# Altium schematic sheet Top.SchDoc
size A4
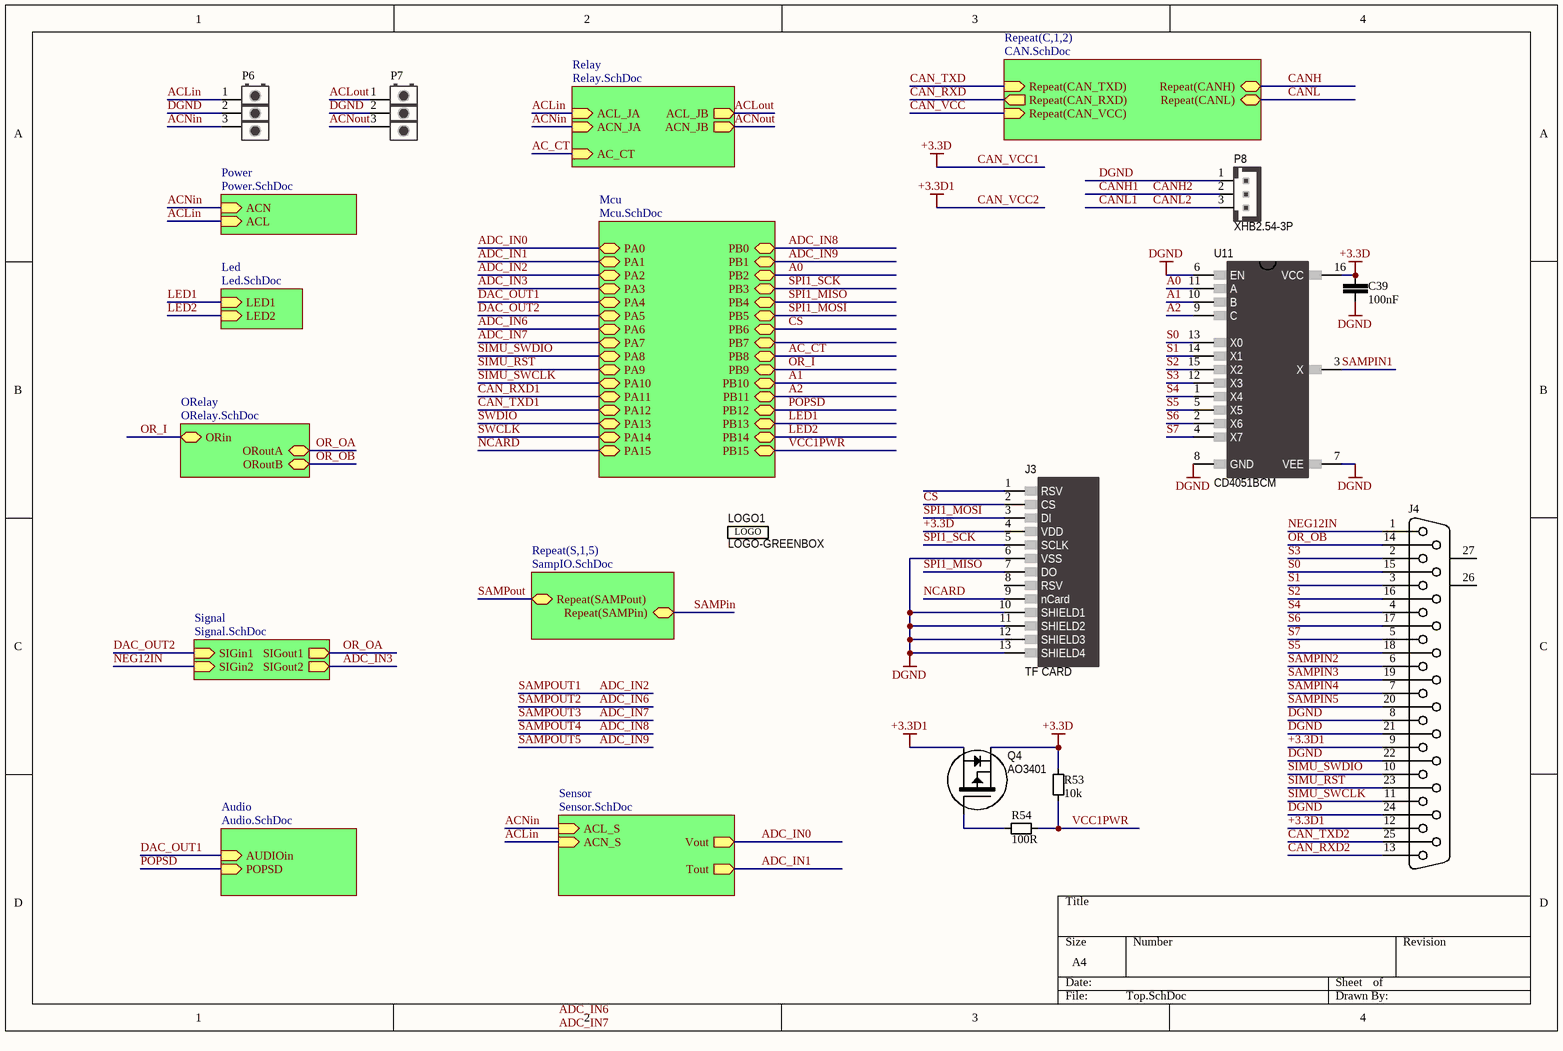
[diagram p0: Top.SchDoc]

## Parts
C39  value 100nF  [0603-C]  (hidden comment: Cap)
J3  TF CARD  [TF-2]
J4  DB25  [DB25F]  (value not drawn)
LOGO1  LOGO-GREENBOX  [LOGO-GREENBOX]
P6  KF7.62-3P  [KF762-3]  (value not drawn)
P7  KF7.62-3P  [KF762-3]  (value not drawn)
P8  XHB2.54-3P  [XH-3]
Q4  AO3401  [SOT-23_N]
R53  value 10k  [0603-R]  (hidden comment: Res)
R54  value 100R  [0603-R]  (hidden comment: Res)
U11  CD4051BCM  [SO-16_N]

## Sub-sheets
Audio = Audio.SchDoc: AUDIOin (in), POPSD (in)
Led = Led.SchDoc: LED1 (in), LED2 (in)
Mcu = Mcu.SchDoc: PA0, PA1, PA2, PA3, PA4, PA5, PA6, PA7, PA8, PA9, PA10, PA11, PA12, PA13, PA14, PA15, PB0, PB1, PB2, PB3, PB4, PB5, PB6, PB7, PB8, PB9, PB10, PB11, PB12, PB13, PB14, PB15
ORelay = ORelay.SchDoc: ORin, ORoutA, ORoutB
Power = Power.SchDoc: ACN (in), ACL (in)
Relay = Relay.SchDoc: ACL_JA (in), ACN_JA (in), ACL_JB (out), ACN_JB (out), AC_CT (in)
Repeat(C,1,2) = CAN.SchDoc: Repeat(CAN_TXD) (in), Repeat(CAN_RXD) (out), Repeat(CANH) (bidir), Repeat(CANL) (bidir), Repeat(CAN_VCC) (in)
Repeat(S,1,5) = SampIO.SchDoc: Repeat(SAMPout), Repeat(SAMPin)
Sensor = Sensor.SchDoc: Vout (out), Tout (out), ACL_S (in), ACN_S (in)
Signal = Signal.SchDoc: SIGin2 (in), SIGout1 (out), SIGin1 (in), SIGout2 (out)

## Nets
+3.3D: C39.1 J3.4(VDD) Q4.2(S) R53.1 U11.16(VCC)  [also labelled CAN_VCC1]
+3.3D1: J4.9 J4.12 Q4.3(D)  [also labelled CAN_VCC2]
DGND: C39.2 J3.6(VSS) J3.10(SHIELD1) J3.11(SHIELD2) J3.12(SHIELD3) J3.13(SHIELD4) J4.8 J4.21 J4.22 J4.24 P6.2 P7.2 P8.1 U11.6(EN) U11.7(VEE) U11.8(GND)
A0: U11.11(A) ; sheet Mcu/PB2
A1: U11.10(B) ; sheet Mcu/PB10
A2: U11.9(C) ; sheet Mcu/PB11
AC_CT: sheet Mcu/PB8, sheet Relay/AC_CT
ACLin: P6.1 ; sheet Power/ACL, sheet Sensor/ACN_S, sheet Relay/ACL_JA
ACLout: P7.1 ; sheet Relay/ACL_JB
ACNin: P6.3 ; sheet Power/ACN, sheet Sensor/ACL_S, sheet Relay/ACN_JA
ACNout: P7.3 ; sheet Relay/ACN_JB
ADC_IN0: sheet Mcu/PA0, sheet Sensor/Vout
ADC_IN1: sheet Mcu/PA1, sheet Sensor/Tout
ADC_IN2: sheet Mcu/PA2  [also labelled SAMPOUT1]
ADC_IN3: sheet Mcu/PA3, sheet Signal/SIGout2
ADC_IN6: sheet Mcu/PA6  [also labelled SAMPOUT2]
ADC_IN7: sheet Mcu/PA7  [also labelled SAMPOUT3]
ADC_IN8: sheet Mcu/PB0  [also labelled SAMPOUT4]
ADC_IN9: sheet Mcu/PB1  [also labelled SAMPOUT5]
CAN_RXD: sheet Repeat(C,1,2)/Repeat(CAN_RXD)
CAN_RXD1: sheet Mcu/PA11
CAN_RXD2: J4.13
CAN_TXD: sheet Repeat(C,1,2)/Repeat(CAN_TXD)
CAN_TXD1: sheet Mcu/PA12
CAN_TXD2: J4.25
CAN_VCC: sheet Repeat(C,1,2)/Repeat(CAN_VCC)
CANH: sheet Repeat(C,1,2)/Repeat(CANH)
CANH1: P8.2  [also labelled CANH2]
CANL: sheet Repeat(C,1,2)/Repeat(CANL)
CANL1: P8.3  [also labelled CANL2]
CS: J3.2(CS) ; sheet Mcu/PB6
DAC_OUT1: sheet Mcu/PA4, sheet Audio/AUDIOin
DAC_OUT2: sheet Mcu/PA5, sheet Signal/SIGin1
LED1: sheet Mcu/PB13, sheet Led/LED1
LED2: sheet Mcu/PB14, sheet Led/LED2
NCARD: J3.9(nCard) ; sheet Mcu/PA15
NEG12IN: J4.1 ; sheet Signal/SIGin2
OR_I: sheet Mcu/PB9, sheet ORelay/ORin
OR_OA: sheet ORelay/ORoutA, sheet Signal/SIGout1
OR_OB: J4.14 ; sheet ORelay/ORoutB
POPSD: sheet Mcu/PB12, sheet Audio/POPSD
S0: J4.15 U11.13(X0)
S1: J4.3 U11.14(X1)
S2: J4.16 U11.15(X2)
S3: J4.2 U11.12(X3)
S4: J4.4 U11.1(X4)
S5: J4.18 U11.5(X5)
S6: J4.17 U11.2(X6)
S7: J4.5 U11.4(X7)
SAMPin: sheet Repeat(S,1,5)/Repeat(SAMPin)
SAMPIN1: U11.3(X)
SAMPIN2: J4.6
SAMPIN3: J4.19
SAMPIN4: J4.7
SAMPIN5: J4.20
SAMPout: sheet Repeat(S,1,5)/Repeat(SAMPout)
SIMU_RST: J4.23 ; sheet Mcu/PA9
SIMU_SWCLK: J4.11 ; sheet Mcu/PA10
SIMU_SWDIO: J4.10 ; sheet Mcu/PA8
SPI1_MISO: J3.7(DO) ; sheet Mcu/PB4
SPI1_MOSI: J3.3(DI) ; sheet Mcu/PB5
SPI1_SCK: J3.5(SCLK) ; sheet Mcu/PB3
SWCLK: sheet Mcu/PA14
SWDIO: sheet Mcu/PA13
VCC1PWR: R53.2 R54.2 ; sheet Mcu/PB15
NetQ4_1: Q4.1(G) R54.1

Not connected (* = marked no-connect by the designer): J3 1(RSV) 8(RSV); J4 26(MH1) 27(MH2)

## Notes on the sheet
- Labels drawn without touching a wire or pin: ADC_IN6, ADC_IN7
- (in symbol LOGO1) LOGO

## Library data of the parts
C39 = C21C100NK1H0: MLCC 100nF 10% 50V X7R 0603; TemperatureRange: -55°C to 150°C; VenderID: MLCC-0603-50V-104K-X7R; Published: 1-Jun-2017; Publisher: GreenBox; MountType: SMT; PackageReference: 0603; Manufacturer: *
J3 = M3DZTF2SPI00: TF CARD Pudsh-Push SPIMode; Manufacturer: TEXAS INSTRUMENTS; VenderID: TF卡座自弹式; Publisher: GreenBox; Published: 1-Jun-2017; PackageReference: TF-2; MountType: SMT; TemperatureRange: *
J4 = PDDD25Z27700: Receptacle Assembly DB25 Vertical; Publisher: GreenBox; Published: 1-Jan-2017; MountType: DIP; PackageReference: DB25F; VenderID: DB25 Vertical; TemperatureRange: *
LOGO1 = LOGO1: Resettable Fuse SMD1206P050TF 1206 500mA; Manufacturer: *; MountType: *; PackageDescription: *; PackageReference: *; Published: 1-Jun-2017; Publisher: GreenBox; TemperatureRange: *; VenderID: *
P6 P7 = PKDK03Z76200: Header KF7.62-3P 7.62mm; Publisher: GreenBox; Published: 1-Jan-2017; MountType: DIP; PackageReference: KF7.62-3P; VenderID: KF7.62-3P; TemperatureRange: *
P8 = P6DX03Z25400: Header XHB2.54-3P 2.54mm; TemperatureRange: -25 to 85°C; Manufacturer: *; MountType: DIP; PackageReference: XH2.54-3P; Published: 1-Jun-2017; Publisher: GreenBox; VenderID: XHB2.54-3P
Q4 = QP42AO34010A: P-Channel MOSFET AO3401 -30V -4.2A; Manufacturer: ALPHA&OMEGA; TemperatureRange: -55 to 150°C; MountType: SMT; PackageReference: SOT-23; Published: 1-Jun-2017; Publisher: GreenBox; VenderID: AO3401
R53 = R11C010KFBF0: SMD Resistor 10k 1% 1/10W 0603 100PPM; TemperatureRange: -55°C to 150°C; VenderID: RES-0603-10k-1%; Published: 1-Jun-2017; Publisher: GreenBox; MountType: SMT; PackageReference: 0603; Manufacturer: *
R54 = R11C100RFBF0: SMD Resistor 100R 1% 1/10W 0603 100PPM; TemperatureRange: -55°C to 150°C; VenderID: RES-0603-100R-1%; Published: 1-Jun-2017; Publisher: GreenBox; MountType: SMT; PackageReference: 0603; Manufacturer: *
U11 = UCS3CD4051B0: SGL ENDED MULTIPLEXER CD4051BCM 8-CHANNEL; TemperatureRange: -55 to 125°C; Manufacturer: *; MountType: SMT; PackageReference: SOIC-16; Published: 1-Jun-2017; Publisher: GreenBox; VenderID: CD4051BCM